# EAGLE schematic TurnON.v1 (EAGLE 5.11)
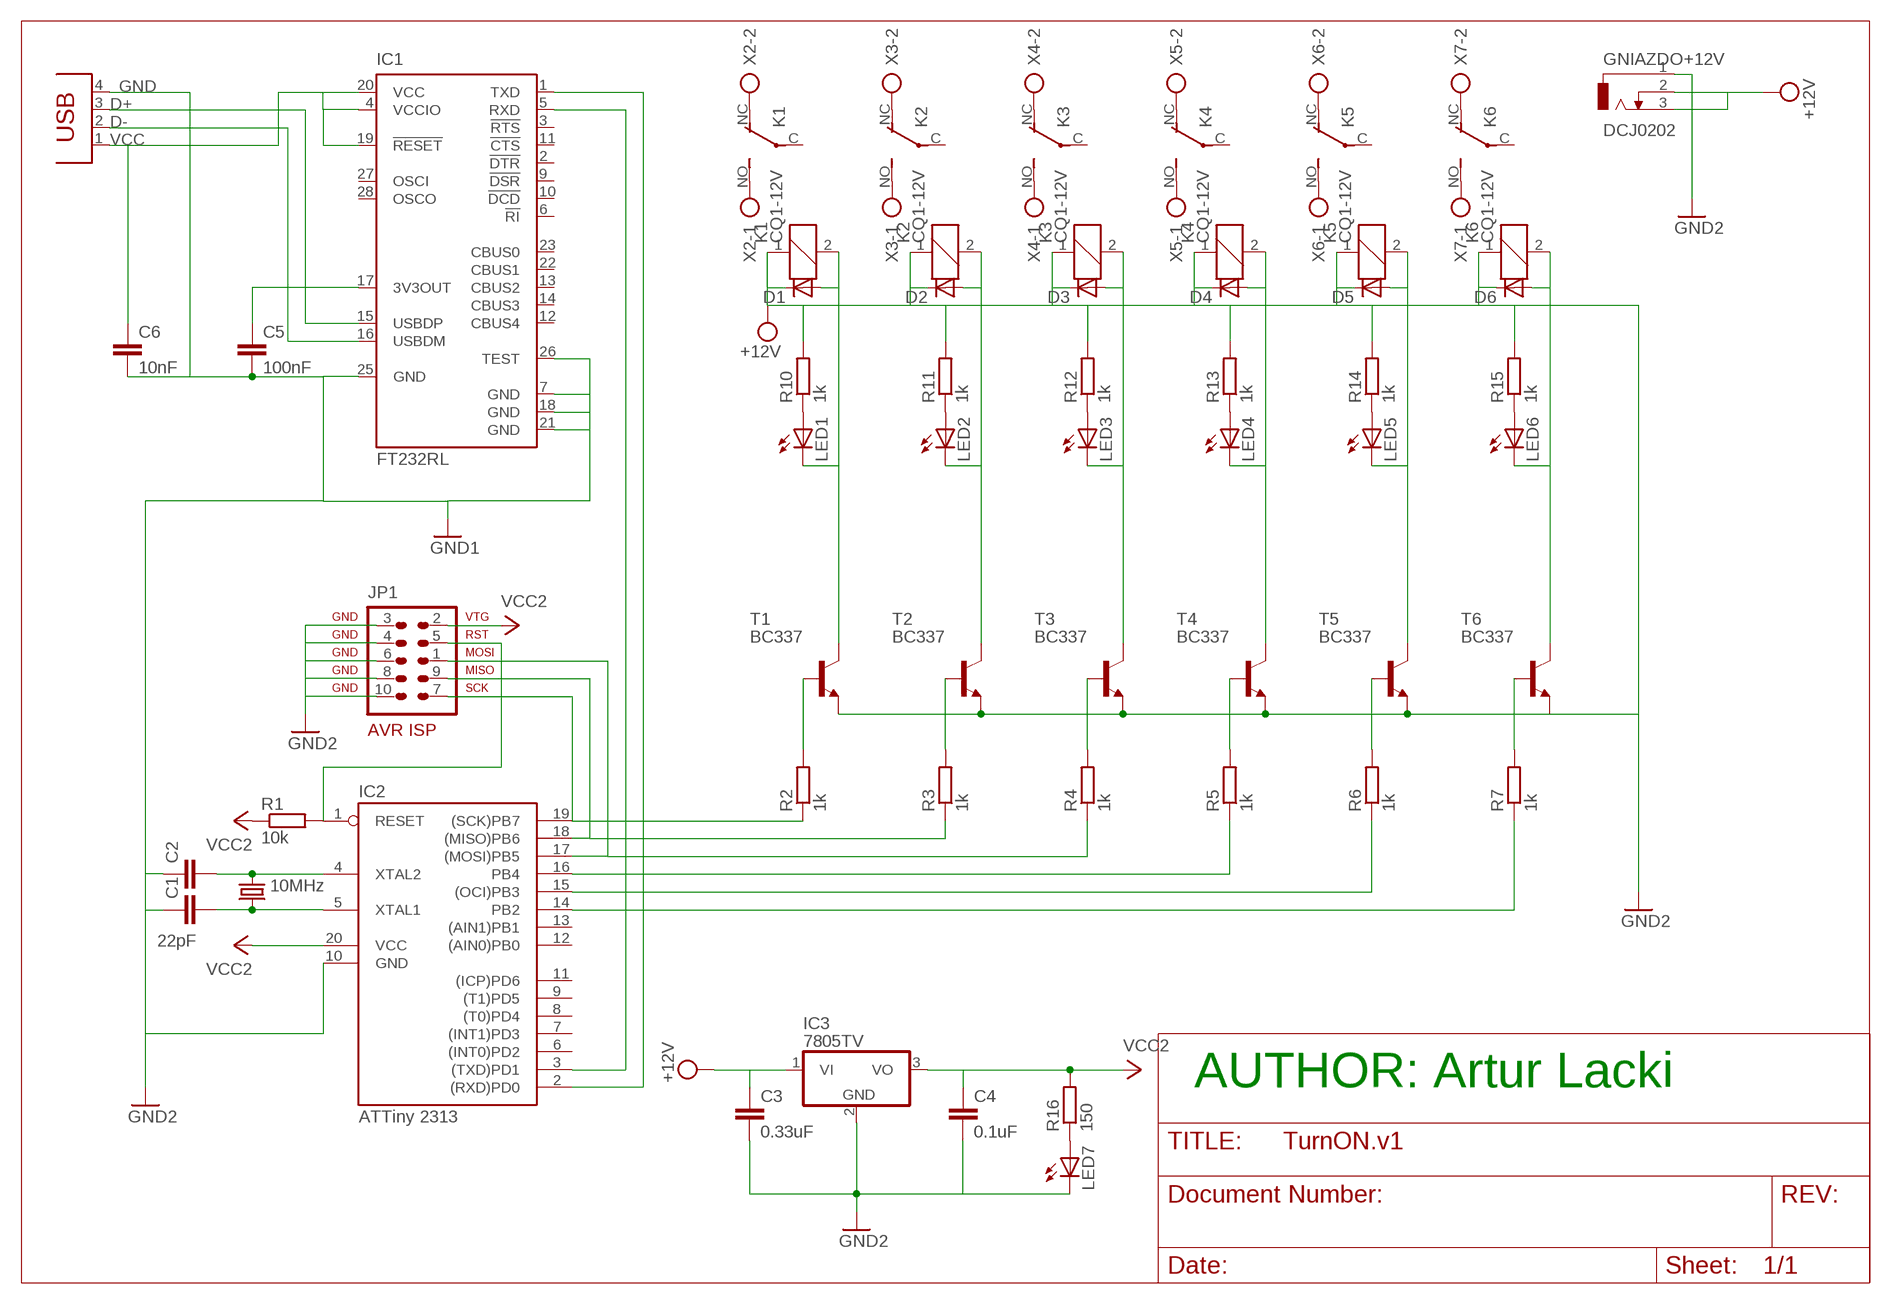
[diagram p0: schematic, sheet 1]

## Parts
C1  22pF  C5/2.5  [C5B2.5]
C2  C5/2.5  [C5B2.5]
C3  0.33uF  C5/2.5  [C5B2.5]
C4  0.1uF  C5/2.5  [C5B2.5]
C5  100nF  C5/2.5  [C5B2.5]
C6  10nF  C5/2.5  [C5B2.5]
D1  1N4148DO35-7  [DO35-7]
D2  1N4148DO35-7  [DO35-7]
D3  1N4148DO35-7  [DO35-7]
D4  1N4148DO35-7  [DO35-7]
D5  1N4148DO35-7  [DO35-7]
D6  1N4148DO35-7  [DO35-7]
GNIAZDO+12V  DCJ0202  [DCJ0202]
IC1  FT232RL  [SSOP28]
IC2  ATTiny 2313  AT90S2313P  [DIL20]
IC3  7805TV  [TO220V]
JP1  AVR-ISP-10  [AVR-ISP-10]
K1  CQ1-12V  [CQ1]
K2  CQ1-12V  [CQ1]
K3  CQ1-12V  [CQ1]
K4  CQ1-12V  [CQ1]
K5  CQ1-12V  [CQ1]
K6  CQ1-12V  [CQ1]
LED1  LED5MM  [LED5MM]
LED2  LED5MM  [LED5MM]
LED3  LED5MM  [LED5MM]
LED4  LED5MM  [LED5MM]
LED5  LED5MM  [LED5MM]
LED6  LED5MM  [LED5MM]
LED7  LED5MM  [LED5MM]
Q1  10MHz  CRYSTALHC49U70  [HC49U70]
R1  10k  R-EU_0207/7  [0207/7]
R2  1k  R-EU_0207/7  [0207/7]
R3  1k  R-EU_0207/7  [0207/7]
R4  1k  R-EU_0207/7  [0207/7]
R5  1k  R-EU_0207/7  [0207/7]
R6  1k  R-EU_0207/7  [0207/7]
R7  1k  R-EU_0207/7  [0207/7]
R10  1k  R-EU_0207/7  [0207/7]
R11  1k  R-EU_0207/7  [0207/7]
R12  1k  R-EU_0207/7  [0207/7]
R13  1k  R-EU_0207/7  [0207/7]
R14  1k  R-EU_0207/7  [0207/7]
R15  1k  R-EU_0207/7  [0207/7]
R16  150  R-EU_0207/7  [0207/7]
T1  BC337  [TO92]
T2  BC337  [TO92]
T3  BC337  [TO92]
T4  BC337  [TO92]
T5  BC337  [TO92]
T6  BC337  [TO92]
X1  PN61729  [PN61729]
X2  AK500/2-H  [AK500/2-H]
X3  AK500/2-H  [AK500/2-H]
X4  AK500/2-H  [AK500/2-H]
X5  AK500/2-H  [AK500/2-H]
X6  AK500/2-H  [AK500/2-H]
X7  AK500/2-H  [AK500/2-H]

## Nets
HH: C1.1 C2.1 C3.2 C4.2 C5.2 C6.2 D1.C D2.C D3.C D4.C D5.C D6.C GNIAZDO+12V.1 IC1.7(GND) IC1.18(GND) IC1.21(GND) IC1.25(GND) IC1.26(TEST) IC2.10(GND) IC3.2(GND) JP1.3 K1.1 K2.1 K3.1 K4.1 K5.1 K6.1 LED7.K(C) R10.2 R11.2 R12.2 R13.2 R14.2 R15.2 T1.1(E) T2.1(E) T3.1(E) T4.1(E) T5.1(E) T6.1(E) X1.4 ; supply symbol labelled GND2, +12V, GND1
N$1: IC2.1(RESET) JP1.5 R1.2
N$2: IC1.15(USBDP) X1.3
N$3: IC1.16(USBDM) X1.2
N$4: C2.2 IC2.4(XTAL2) Q1.1
N$5: C1.2 IC2.5(XTAL1) Q1.2
N$6: IC1.5(RXD) IC2.3((TXD)PD1)
N$7: IC1.1(TXD) IC2.2((RXD)PD0)
N$8: R2.2 T1.2(B)
N$9: JP1.4
N$10: JP1.6
N$11: JP1.8
N$12: JP1.10
N$13: R3.2 T2.2(B)
N$14: R4.2 T3.2(B)
N$15: IC2.19((SCK)PB7) JP1.7 R2.1
N$16: IC2.18((MISO)PB6) JP1.9 R3.1
N$17: IC2.17((MOSI)PB5) JP1.1 R4.1
N$18: IC2.16(PB4) R5.1
N$19: R5.2 T4.2(B)
N$20: IC2.15((OCI)PB3) R6.1
N$21: IC2.14(PB2) R7.1
N$22: K1.NO(2:S) X2.1
N$23: C5.1 IC1.17(3V3OUT)
N$24: R6.2 T5.2(B)
N$25: R7.2 T6.2(B)
N$26: K1.NC(2:O) X2.2
N$27: K2.NO(2:S) X3.1
N$28: LED7.A R16.1
N$34: K2.NC(2:O) X3.2
N$35: K3.NO(2:S) X4.1
N$36: LED1.A R10.1
N$37: LED2.A R11.1
N$38: LED3.A R12.1
N$39: LED4.A R13.1
N$40: LED5.A R14.1
N$41: LED6.A R15.1
N$42: K3.NC(2:O) X4.2
N$43: K4.NC(2:O) X5.2
N$44: C6.1 IC1.4(VCCIO) IC1.19(!RESET) IC1.20(VCC) X1.1
N$45: K4.NO(2:S) X5.1
N$46: K5.NC(2:O) X6.2
N$47: K5.NO(2:S) X6.1
N$48: K6.NC(2:O) X7.2
N$49: K6.NO(2:S) X7.1
N$51: D1.A K1.2 LED1.K(C) T1.3(C)
N$63: D2.A K2.2 LED2.K(C) T2.3(C)
N$64: D3.A K3.2 LED3.K(C) T3.3(C)
N$65: D4.A K4.2 LED4.K(C) T4.3(C)
N$66: D5.A K5.2 LED5.K(C) T5.3(C)
N$67: D6.A K6.2 LED6.K(C) T6.3(C)
VCC: C3.1 C4.1 GNIAZDO+12V.2 GNIAZDO+12V.3 IC2.20(VCC) IC3.1(VI) IC3.3(VO) JP1.2 R1.1 R16.2 ; supply symbol labelled VCC2, +12V
Unconnected: IC1.2(!DTR) IC1.3(!RTS) IC1.6(!RI) IC1.9(!DSR) IC1.10(!DCD) IC1.11(!CTS) IC1.12(CBUS4) IC1.13(CBUS2) IC1.14(CBUS3) IC1.22(CBUS1) IC1.23(CBUS0) IC1.27(OSCI) IC1.28(OSCO) IC2.6((INT0)PD2) IC2.7((INT1)PD3) IC2.8((T0)PD4) IC2.9((T1)PD5) IC2.11((ICP)PD6) IC2.12((AIN0)PB0) IC2.13((AIN1)PB1) K1.C(2:P) K2.C(2:P) K3.C(2:P) K4.C(2:P) K5.C(2:P) K6.C(2:P)

## Notes on the sheet
- GND
- D+
- D-
- VCC
- AUTHOR: Artur Lacki

## Library data of the parts
C1-C6 = capacitor-wima:C: CAPACITOR naming: grid - package width
D1-D6 = diode:1N4148: DIODE high speed (Philips)
GNIAZDO+12V = con-jack:DCJ0202: DC POWER JACK Source: DCJ0202.pdf; OC_FARNELL: unknown; OC_NEWARK: unknown
IC1 = ftdichip:FT232R: Source: http://www.ftdichip.com/Documents/DataSheets/DS_FT232R_v104.pdf; MPN: FT232RL; OC_FARNELL: 1146032; OC_NEWARK: 91K9918
IC2 = atmel:AT90S2313: MICROCONTROLLER 2 Kbytes FLASH 128 bytes SRAM 128 bytes EEPROM UART; OC_FARNELL: unknown; OC_NEWARK: unknown
IC3 = linear:78*: Positive VOLTAGE REGULATOR Source: http://cache.national.com/ds/LM/LM78L05.pdf http://www.fairchildsemi.com/ds/LM/LM7805.pdf
JP1 = atmel-isp:AVR-ISP-10: AVR ISP-10 Serial Programming Header
K1-K6 = relay:CQ1-12V: AUTOMOTIVE QUIET RELAY NAiS Source: http://www.mew-europe.com/.. en_ds_61208_0000.pdf; OC_FARNELL: unknown; OC_NEWARK: unknown
LED1-LED7 = led:LED: LED OSRAM: - CHIPLED LG R971, LG N971, LY N971, LG Q971, LY Q971, LO R971, LY R971 LH N974, LH R974 LS Q976, LO Q976, LY Q976 LO Q996 - Hyper CHIPLED LW Q18S LB Q993, LB Q99A, LB R99A - SideLED LS A670, LO A670, LY A670, LG A670, LP A670 LB A673, LV A673, LT A673, LW A673 LH A674 LY A675 LS A676, LA A676, LO A676, LY A676, LW A676 LS A679, LY A679, LG A679 - Hyper Micro SIDELED® LS Y876, LA Y876, LO Y876, LY Y876 LT Y87S - SmartLED LW L88C, LW L88S LB L89C, LB L89S, LG L890 LS L89K, LO L89K, LY L89K LS L896, LA L896, LO L896, LY L896 - TOPLED LS T670, LO T670, LY T670, LG T670, LP T670 LSG T670, LSP T670, LSY T670, LOP T670, LYG T670 LG T671, LOG T671, LSG T671 LB T673, LV T673, LT T673, LW T673 LH T674 LS T676, LA T676, LO T676, LY T676, LB T676, LH T676, LSB T676, LW T676 LB T67C, LV T67C, LT T67C, LS T67K, LO T67K, LY T67K, LW E67C LS E67B, LA E67B, LO E67B, LY E67B, LB E67C, LV E67C, LT E67C LW T67C LS T679, LY T679, LG T679 LS T770, LO T770, LY T770, LG T770, LP T770 LB T773, LV T773, LT T773, LW T773 LH T774 LS E675, LA E675, LY E675, LS T675 LS T776, LA T776, LO T776, LY T776, LB T776 LHGB T686 LT T68C, LB T68C - Hyper Mini TOPLED® LB M676 - Mini TOPLED Santana® LG M470 LS M47K, LO M47K, LY M47K Source: http://www.osram.convergy.de LUXEON: - LUMILED® LXK2-PW12-R00, LXK2-PW12-S00, LXK2-PW14-U00, LXK2-PW14-V00 LXK2-PM12-R00, LXK2-PM12-S00, LXK2-PM14-U00 LXK2-PE12-Q00, LXK2-PE12-R00, LXK2-PE12-S00, LXK2-PE14-T00, LXK2-PE14-U00 LXK2-PB12-K00, LXK2-PB12-L00, LXK2-PB12-M00, LXK2-PB14-N00, LXK2-PB14-P00, LXK2-PB14-Q00 LXK2-PR12-L00, LXK2-PR12-M00, LXK2-PR14-Q00, LXK2-PR14-R00 LXK2-PD12-Q00, LXK2-PD12-R00, LXK2-PD12-S00 LXK2-PH12-R00, LXK2-PH12-S00 LXK2-PL12-P00, LXK2-PL12-Q00, LXK2-PL12-R00 Source: www.luxeon.com KINGBRIGHT: KA-3528ASYC Source: www.kingbright.com
Q1 = crystal:CRYSTAL: CRYSTAL; OC_FARNELL: unknown; OC_NEWARK: unknown
R1-R7 R10-R16 = rcl:R-EU_: RESISTOR, European symbol
T1-T6 = transistor:BC337: NPN TRANSISTOR
X1 = con-berg:PN61729: BERG USB connector; OC_FARNELL: unknown; OC_NEWARK: unknown
X2-X7 = con-ptr500:AK500/2-H: CONNECTOR Aug. 2004 / PTR Meßtechnik: Die Bezeichnung der Serie AK505 wurde geändert. Es handelt sich hierbei um AK500 in horizontaler Ausführung.; OC_FARNELL: unknown; OC_NEWARK: unknown